# Altium schematic sheet [16] - POWERS 5V, 3V3.SchDoc
size A2; DocumentNumber: 2; SheetNumber: 16; SheetTotal: 20
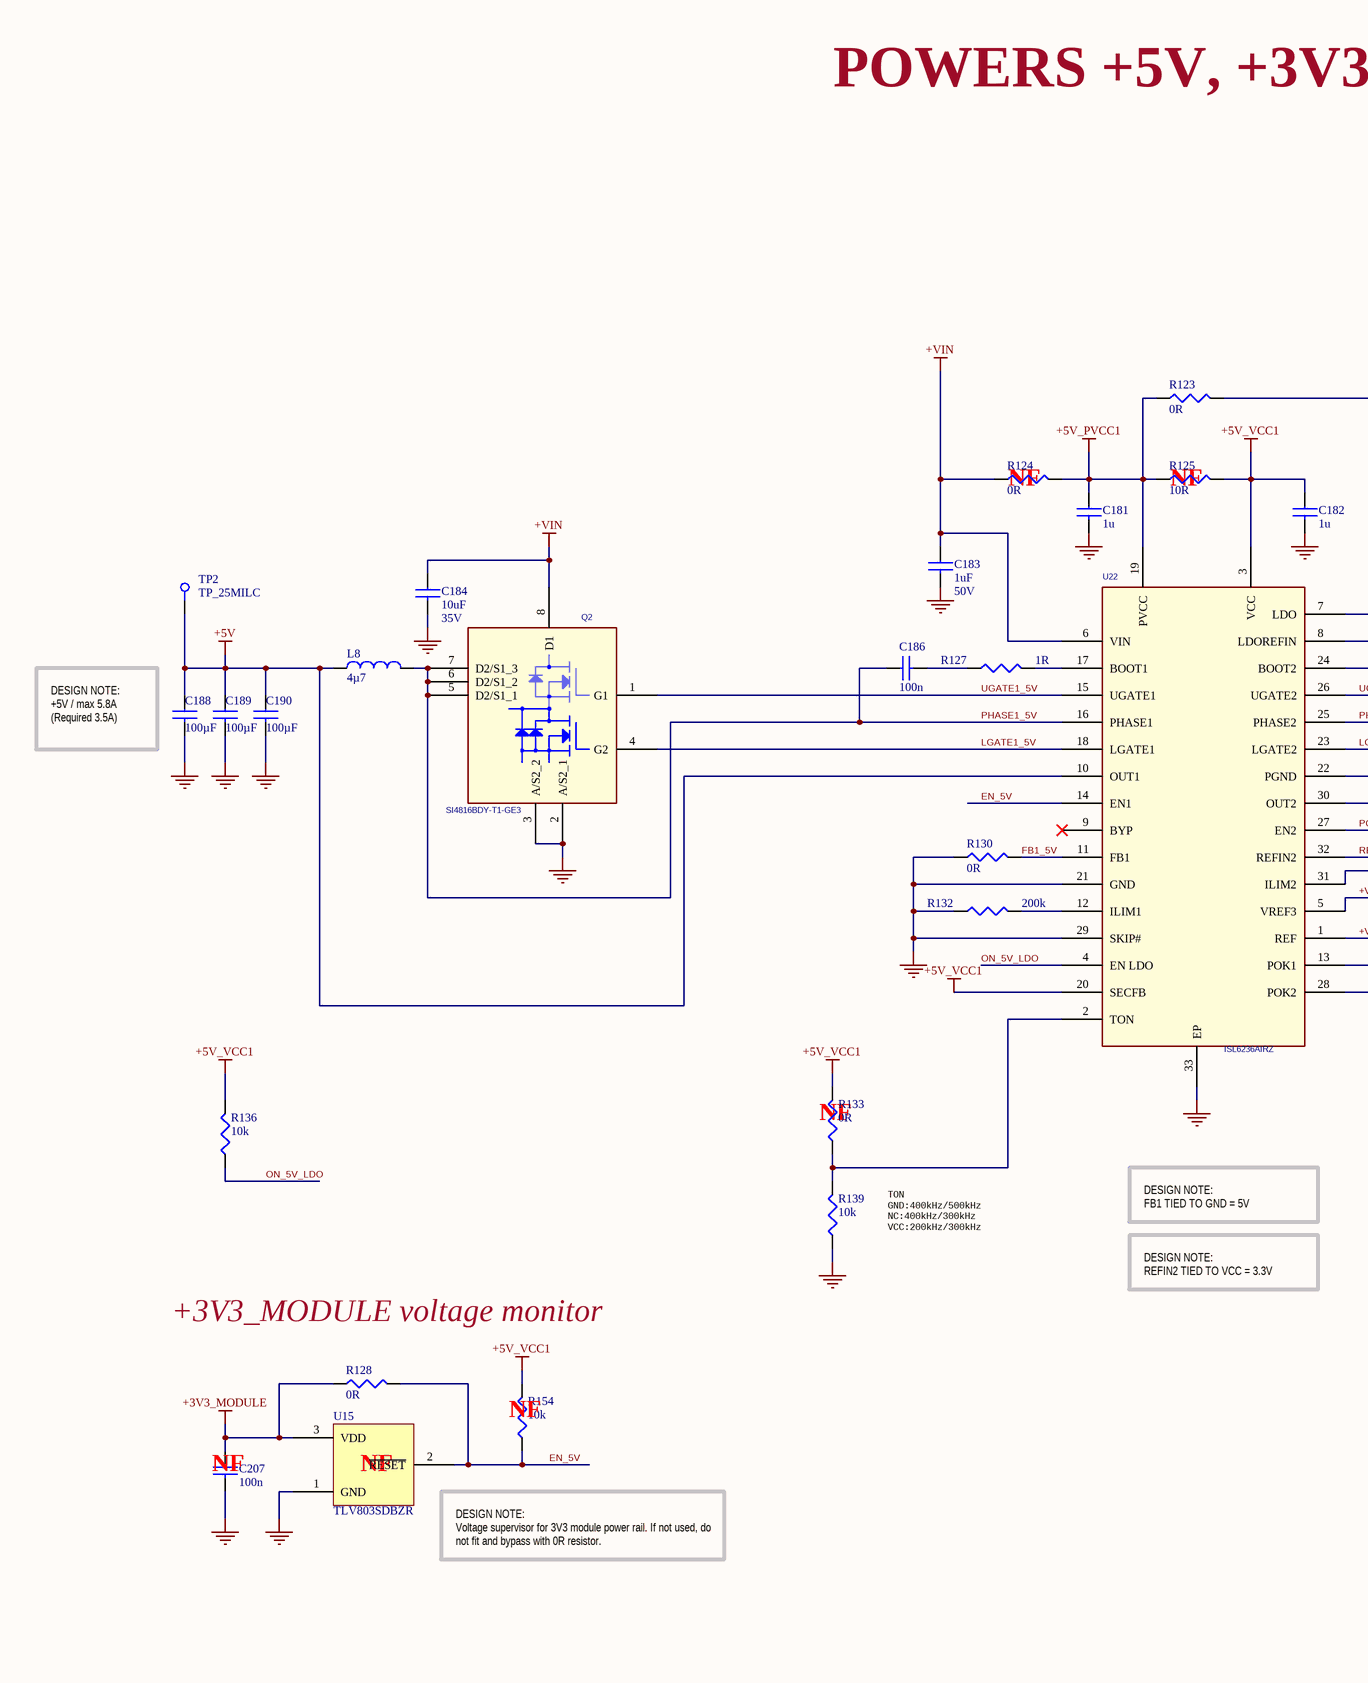
[diagram p0: [16] - POWERS 5V, 3V3.SchDoc, left]
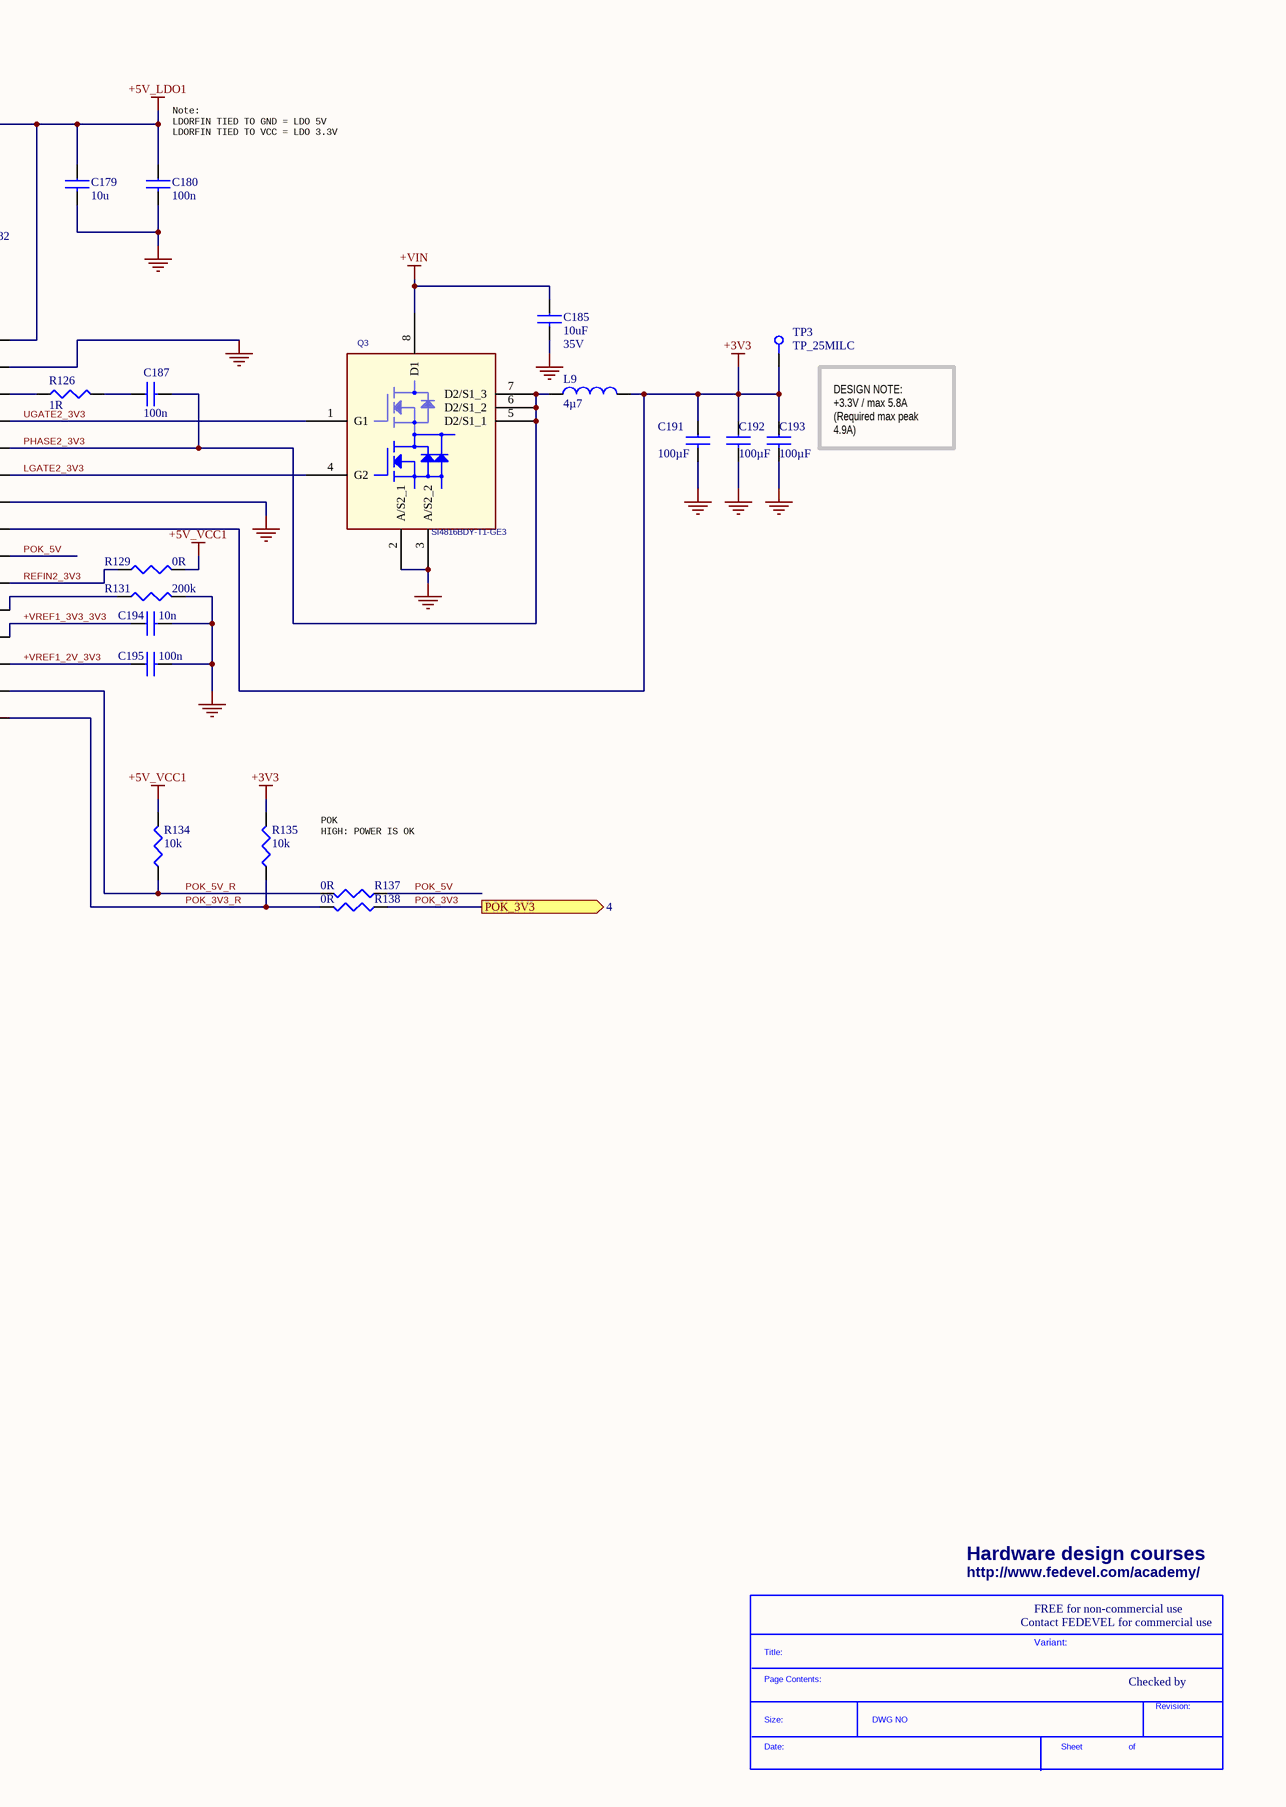
[diagram p1: [16] - POWERS 5V, 3V3.SchDoc, right]

## Parts
*  SDTitleBlock  (value not drawn)  (graphical)
C179  10u  [C0603]
C180  100n  [C0402]
C181  1u  [C0402]
C182  1u  [C0402]
C183  1uF  Voltage - Rated: 50V  [C0805]
C184  10uF  Voltage - Rated: 35V  [C1206]
C185  10uF  Voltage - Rated: 35V  [C1206]
C186  100n  [C0402]
C187  100n  [C0402]
C188  100µF  [C1206]
C189  100µF  [C1206]
C190  100µF  [C1206]
C191  100µF  [C1206]
C192  100µF  [C1206]
C193  100µF  [C1206]
C194  10n  [C0402]
C195  100n  [C0402]
C207  100n  [C0402]
L8  4µ7  [IHLP_255MILx270MIL]
L9  4µ7  [IHLP_255MILx270MIL]
Q2  SI4816BDY-T1-GE3  [8_SOIC_3.9MM]
Q3  SI4816BDY-T1-GE3  [8_SOIC_3.9MM]
R123  0R  [R0402]
R124  0R  [R0402]
R125  10R  [R0402]
R126  1R  [R0402]
R127  1R  [R0402]
R128  0R  [R0402]
R129  0R  [R0402]
R130  0R  [R0402]
R131  200k  [R0402]
R132  200k  [R0402]
R133  0R  [R0402]
R134  10k  [R0402]
R135  10k  [R0402]
R136  10k  [R0402]
R137  0R  [R0402]
R138  0R  [R0402]
R139  10k  [R0402]
R154  10k  [R0402]
TP2  TP_25MILC  [TP_25C]  (no BOM)
TP3  TP_25MILC  [TP_25C]  (no BOM)
U15  TLV803SDBZR  [DBZ]
U22  ISL6236AIRZ  [32_VFQFN_EXPOSED_PAD]

## Ports
POK_3V3 (see 4)

## Nets
+3V3: C191.1 C192.1 C193.1 L9.2 R135.2 TP3.1 U22.30(OUT2)
+3V3_MODULE: C207.1 R128.1 U15.3(VDD)
+5V: C188.1 C189.1 C190.1 L8.1 TP2.1 U22.10(OUT1)
+5V_LDO1: C179.1 C180.1 R123.2 U22.7(LDO)
+5V_PVCC1: C181.1 R123.1 R124.2 R125.1 U22.19(PVCC)
+5V_VCC1: C182.1 R125.2 R129.2 R133.2 R134.2 R136.2 R154.2 U22.3(VCC) U22.20(SECFB)
+VIN: C183.1 C184.1 C185.1 Q2.8(D1) Q3.8(D1) R124.1 U22.6(VIN)
GND: C179.2 C180.2 C181.2 C182.2 C183.2 C184.2 C185.2 C188.2 C189.2 C190.2 C191.2 C192.2 C193.2 C194.2 C195.2 C207.2 Q2.2(A/S2_1) Q2.3(A/S2_2) Q3.2(A/S2_1) Q3.3(A/S2_2) R130.1 R131.2 R132.1 R139.1 U15.1(GND) U22.8(LDOREFIN) U22.21(GND) U22.22(PGND) U22.29(SKIP#) U22.33(EP)
+VREF1_2V_3V3: C195.1 U22.1(REF)
+VREF1_3V3_3V3: C194.1 U22.5(VREF3)
EN_5V: R128.2 R154.1 U15.2(~{RESET}) U22.14(EN1)
FB1_5V: R130.2 U22.11(FB1)
LGATE1_5V: Q2.4(G2) U22.18(LGATE1)
LGATE2_3V3: Q3.4(G2) U22.23(LGATE2)
ON_5V_LDO: R136.1 U22.4(EN_LDO)
PHASE1_5V: C186.1 L8.2 Q2.5(D2/S1_1) Q2.6(D2/S1_2) Q2.7(D2/S1_3) U22.16(PHASE1)
PHASE2_3V3: C187.2 L9.1 Q3.5(D2/S1_1) Q3.6(D2/S1_2) Q3.7(D2/S1_3) U22.25(PHASE2)
POK_3V3: R138.1 ; port POK_3V3
POK_3V3_R: R135.1 R138.2 U22.28(POK2)
POK_5V: R137.1 U22.27(EN2)
POK_5V_R: R134.1 R137.2 U22.13(POK1)
REFIN2_3V3: R129.1 U22.32(REFIN2)
UGATE1_5V: Q2.1(G1) U22.15(UGATE1)
UGATE2_3V3: Q3.1(G1) U22.26(UGATE2)
NetC186_2: C186.2 R127.1
NetC187_1: C187.1 R126.2
NetR126_1: R126.1 U22.24(BOOT2)
NetR127_2: R127.2 U22.17(BOOT1)
NetR131_1: R131.1 U22.31(ILIM2)
NetR132_2: R132.2 U22.12(ILIM1)
NetR133_1: R133.1 R139.2 U22.2(TON)

Not connected (* = marked no-connect by the designer): U22 9(BYP)*

## Notes on the sheet
- POWERS +5V, +3V3
- (near C180) Note:
  LDORFIN TIED TO GND = LDO 5V
  LDORFIN TIED TO VCC = LDO 3.3V
- (near R124) NF
- (near R125) NF
- (near C188) DESIGN NOTE:
  +5V / max 5.8A
  (Required 3.5A)
- DESIGN NOTE:
  +3.3V / max 5.8A
  (Required max peak 4.9A)
- (near R133) NF
- POK
  HIGH: POWER IS OK
- DESIGN NOTE:
  FB1 TIED TO GND = 5V
- TON
  GND:400kHz/500kHz
  NC:400kHz/300kHz
  VCC:200kHz/300kHz
- DESIGN NOTE:
  REFIN2 TIED TO VCC = 3.3V
- +3V3_MODULE voltage monitor
- (near R154) NF
- (near C207) NF
- (near U15) NF
- DESIGN NOTE:
  Voltage supervisor for 3V3 module power rail. If not used, do not fit and bypass with 0R resistor.
- Hardware design courses
- http://www.fedevel.com/academy/
- Contact FEDEVEL for commercial use
- FREE for non-commercial use
- Variant:
- Checked by
- (in symbol SDTitleBlock) Title:; Page Contents:; Revision:; Size:; DWG NO; Date:; Sheet; of

## Library data of the parts
C179 = C1608X5R0J106M: CAP CER 10UF 6.3V X5R 20% 0603; Manufacturer: TDK Corporation; Capacitance: 10µF; Value: 10µF; .Checked PCB: used; Description: CAP CER 10UF 6.3V 20% X5R 0603; Category: Capacitors; Manufacturer Part Number: C1608X5R0J106M; Operating Temperature: -55°C ~ 85°C; Package / Case: 0603 (1608 Metric); Price 1k [$]: 0.08580; .Checked SCH: used; Voltage - Rated: 6.3V; Features: Low ESR; Supplier Part Number: 445-4112-1-ND; Supplier: Digikey; Supplier 1: Digi-Key; Supplier Part Number 1: 445-4112-1-ND; RoHS: RoHS Compliant; Stock 1: 48157; Pricing 1: 1=0.46, 10=0.363, 100=0.1898, 250=0.14024, 500=0.1089, 1000=0.0858 (USD); Tolerance: ±20%; Temperature Coefficient: X5R; Mounting Type: Surface Mount, MLCC; Applications: General Purpose; Ratings: -; Size / Dimension: 0.063" L x 0.031" W (1.60mm x 0.80mm); Height - Seated (Max): -; Thickness (Max): 0.037" (0.95mm); Lead Spacing: -; Packaging: Cut Tape (CT); Lead Style: -; ComponentLink1URL: http://www.tdk.com/pdf/general_B11.pdf; ComponentLink1Description: http://www.tdk.com/pdf/general_B11.pdf
C180 C186 C187 C195 C207 = C1005X5R1H104K: CAP CER .10UF 50V X5R 10% 0402; Manufacturer: TDK Corporation; Capacitance: 0.1µF; Value: 100nF; .Checked PCB: used; Description: CAP CER 0.1UF 50V 10% X5R 0402; Category: Capacitors; Manufacturer Part Number: C1005X5R1H104K; Operating Temperature: -55°C ~ 85°C; Package / Case: 0402 (1005 Metric); Price 1k [$]: 0.02340; .Checked SCH: used; Voltage - Rated: 50V; Supplier Part Number: 445-5942-1-ND; Supplier: Digikey; Supplier 1: Digi-Key; Supplier Part Number 1: 445-5942-1-ND; RoHS: RoHS Compliant; Stock 1: 106926; Pricing 1: 1=0.27, 10=0.18, 100=0.072, 250=0.05176, 500=0.0369, 1000=0.027 (USD); Tolerance: ±10%; Temperature Coefficient: X5R; Mounting Type: Surface Mount, MLCC; Applications: General Purpose; Ratings: -; Size / Dimension: 0.039" L x 0.020" W (1.00mm x 0.50mm); Height - Seated (Max): -; Thickness (Max): 0.022" (0.55mm); Lead Spacing: -; Features: -; Packaging: Cut Tape (CT); Lead Style: -; ComponentLink1URL: http://www.tdk.co.jp/tefe02/e412_c.pdf; ComponentLink1Description: http://www.tdk.co.jp/tefe02/e412_c.pdf
C181 C182 = C1005X5R1C105K: CAP CER 1.0UF 16V X5R 0402; Manufacturer: TDK Corporation; Capacitance: 1.0µF; Value: 1uF; .Checked PCB: used; Description: CAP CER 1UF 16V 10% X5R 0402; Tolerance: ±10%; Category: Capacitors; Manufacturer Part Number: C1005X5R1C105K; Operating Temperature: -55°C ~ 85°C; Package / Case: 0402 (1005 Metric); Price 1k [$]: 0.02080; .Checked SCH: used; Voltage - Rated: 16V; Supplier Part Number: 445-4978-1-ND; Supplier: Digikey; Supplier 1: Digi-Key; Supplier Part Number 1: 445-4978-1-ND; RoHS: RoHS Compliant; Stock 1: 341010; Pricing 1: 1=0.24, 10=0.16, 100=0.064, 250=0.046, 500=0.0328, 1000=0.024 (USD); Temperature Coefficient: X5R; Mounting Type: Surface Mount, MLCC; Applications: General Purpose; Ratings: -; Size / Dimension: 0.039" L x 0.020" W (1.00mm x 0.50mm); Height - Seated (Max): -; Thickness (Max): 0.022" (0.55mm); Lead Spacing: -; Features: -; Packaging: Cut Tape (CT); Lead Style: -; ComponentLink1URL: http://www.tdk.co.jp/tefe02/e412_c.pdf; ComponentLink1Description: http://www.tdk.co.jp/tefe02/e412_c.pdf
C183 = GRM21BR71H105KA12L: CAP CER 1UF 50V X7R 0805; Manufacturer: Murata Electronics North America; Capacitance: 1.0µF; .Checked PCB: used; Description: CAP CER 1UF 50V 10% X7R 0805; Tolerance: ±10%; Category: Capacitors; Manufacturer Part Number: GRM21BR71H105KA12L; Operating Temperature: -55°C ~ 125°C; Package / Case: 0805 (2012 Metric); Price 1k [$]: 0.1359; Value: 1uF; .Checked SCH: used; Supplier Part Number: 490-4736-1-ND; Supplier: Digikey; Supplier 1: Digi-Key; Supplier Part Number 1: 490-4736-1-ND; RoHS: RoHS Compliant; Stock 1: 422791; Pricing 1: 1=0.28, 10=0.254, 25=0.226, 50=0.1978, 100=0.1836, 250=0.16952, 500=0.16102, 750=0.14691, 1000=0.12995 (USD); Temperature Coefficient: X7R; Mounting Type: Surface Mount, MLCC; Applications: General Purpose; Ratings: -; Size / Dimension: 0.079" L x 0.049" W (2.00mm x 1.25mm); Height - Seated (Max): -; Thickness (Max): 0.053" (1.35mm); Lead Spacing: -; Features: -; Packaging: Cut Tape (CT); Lead Style: -; ComponentLink1URL: http://search.murata.co.jp/Ceramy/image/img/PDF/ENG/GRM21BR71H105KA12.pdf; ComponentLink1Description: http://search.murata.co.jp/Ceramy/image/img/PDF/ENG/GRM21BR71H105KA12.pdf
C184 C185 = GRM31CR6YA106KA12L: CAP CER 10UF 35V X5R 1206; Manufacturer: Murata Electronics North America; Capacitance: 10µF; .Checked PCB: used; Description: CAP CER 10UF 35V 10% X5R 1206; Tolerance: ±10%; Category: Capacitors; Manufacturer Part Number: GRM31CR6YA106KA12L; Operating Temperature: -55°C ~ 85°C; Package / Case: 1206 (3216 Metric); Price 1k [$]: 0.19448; Value: 10uF; .Checked SCH: used; Supplier Part Number: 490-5524-1-ND; Supplier: Digikey; Supplier 1: Digi-Key; Supplier Part Number 1: 490-5524-1-ND; RoHS: RoHS Compliant; Stock 1: 76334; Pricing 1: 1=0.6, 10=0.501, 50=0.359, 100=0.3142, 250=0.24684, 500=0.2244, 1000=0.17952 (USD); Temperature Coefficient: X5R; Mounting Type: Surface Mount, MLCC; Applications: General Purpose; Ratings: -; Size / Dimension: 0.126" L x 0.063" W (3.20mm x 1.60mm); Height - Seated (Max): -; Thickness (Max): 0.071" (1.80mm); Lead Spacing: -; Features: -; Packaging: Cut Tape (CT); Lead Style: -; ComponentLink1URL: http://www.murata.com/products/catalog/pdf/c02e.pdf; ComponentLink1Description: http://www.murata.com/products/catalog/pdf/c02e.pdf
C188-C193 = C3216X5R1A107M: CAP CER 100UF 10V X5R 20% 1206; Manufacturer: TDK Corporation; .Checked PCB: used; Description: CAP CER 100UF 10V 20% X5R 1206; Capacitance: 100µF; Category: Capacitors; Manufacturer Part Number: C3216X5R1A107M; Operating Temperature: -55°C ~ 85°C; Package / Case: 1206 (3216 Metric); Price 1k [$]: 0.85800; Value: 100µF; .Checked SCH: used; Voltage - Rated: 10V; Supplier Part Number: 445-6007-1-ND; Supplier: Digikey; Supplier 1: Digi-Key; Supplier Part Number 1: 445-6007-1-ND; RoHS: RoHS Compliant; Stock 1: 28026; Pricing 1: 1=1.65, 10=1.353, 100=1.089, 250=0.957, 500=0.891, 1000=0.693 (USD); Tolerance: ±20%; Temperature Coefficient: X5R; Mounting Type: Surface Mount, MLCC; Applications: General Purpose; Ratings: -; Size / Dimension: 0.126" L x 0.063" W (3.20mm x 1.60mm); Height - Seated (Max): -; Thickness (Max): 0.071" (1.80mm); Lead Spacing: -; Features: -; Packaging: Cut Tape (CT); Lead Style: -; ComponentLink1URL: http://www.tdk.com/pdf/general_B11.pdf; ComponentLink1Description: http://www.tdk.com/pdf/general_B11.pdf
C194 = C1005X7R1C103K: CAP CER 10000PF 16V X7R 10% 0402; Manufacturer: TDK Corporation; Value: 10nF; .Checked PCB: used; Description: CAP CER 10000PF 16V 10% X7R 0402; Capacitance: 10000pF; Category: Capacitors; Manufacturer Part Number: C1005X7R1C103K; Operating Temperature: -55°C ~ 125°C; Package / Case: 0402 (1005 Metric); Price 1k [$]: 0.00416; .Checked SCH: used; Voltage - Rated: 16V; Supplier Part Number: 445-1262-1-ND; Supplier: Digikey; Supplier 1: Digi-Key; Supplier Part Number 1: 445-1262-1-ND; RoHS: RoHS Compliant; Stock 1: 511497; Pricing 1: 1=0.08, 10=0.05, 100=0.018, 250=0.013, 500=0.0096, 1000=0.0065 (USD); Tolerance: ±10%; Temperature Coefficient: X7R; Mounting Type: Surface Mount, MLCC; Applications: General Purpose; Ratings: -; Size / Dimension: 0.039" L x 0.020" W (1.00mm x 0.50mm); Height - Seated (Max): -; Thickness (Max): 0.022" (0.55mm); Lead Spacing: -; Features: -; Packaging: Cut Tape (CT); Lead Style: -; ComponentLink1URL: http://www.tdk.co.jp/tefe02/e412_c.pdf; ComponentLink1Description: http://www.tdk.co.jp/tefe02/e412_c.pdf
L8 L9 = IHLP2525CZER4R7M01: INDUCTOR POWER 4.7UH 5.5A SMD; Manufacturer: Vishay/Dale; .Checked PCB: used; Inductance: 4.7µH; Current - Saturation: 10A; Shielding: Shielded; DC Resistance (DCR): 40 mOhm Max; Tolerance: ±20%; Frequency - Test: 100kHz; .Checked SCH: used; Category: Inductors, Coils, Chokes; Manufacturer Part Number: IHLP2525CZER4R7M01; Operating Temperature: -55°C ~ 125°C; Package / Case: 0.270" L x 0.255" W x 0.118" H (6.86mm x 6.47mm x 3.00mm); Price 1k [$]: 1.09800; Value: 4µ7; Current: 5.5A; Applications: General Purpose; Supplier Part Number: 541-1010-1-ND; Supplier: Digikey; Supplier 1: Digi-Key; Supplier Part Number 1: 541-1010-1-ND; RoHS: RoHS Compliant; Stock 1: 25684; Pricing 1: 1=2.26, 10=1.83, 100=1.525, 500=1.22, 1000=1.098 (USD); Current - Temperature Rise: 5.5A; Type: -; Q @ Freq: -; Frequency - Self Resonant: -; Material - Core: -; Mounting Type: Surface Mount; Packaging: Cut Tape (CT); ComponentLink1URL: http://www.vishay.com/doc?34104; ComponentLink1Description: http://www.vishay.com/doc?34104
Q2 Q3 = SI4816BDY-T1-GE3: MOSFET DL N-CH 30V 6.8A 8-SOIC; Manufacturer: Vishay/Siliconix; .Checked PCB: used; FET Type: 2 N-Channel (Dual); FET Feature: Logic Level Gate; Rds On (Max) @ Id, Vgs: 18.5 mOhm @ 6.8A, 10V; Current - Continuous Drain (Id) @ 25° C: 5.8A, 8.2A; Vgs(th) (Max) @ Id: 3V @ 250µA; Power - Max: 1W, 1.25W; Gate Charge (Qg) @ Vgs: 10nC @ 5V; .Checked SCH: used; Category: Discrete Semiconductor Products; Manufacturer Part Number: SI4816BDY-T1-GE3; Package / Case: 8-SOIC (0.154", 3.90mm Width); Price 1k [$]: 0.84800; Value: SI4816BDY-T1-GE3; Family: FETs - Arrays; Drain to Source Voltage (Vdss): 30V; Supplier Part Number: SI4816BDY-T1-GE3CT-ND; Supplier: Digikey; Supplier 1: Digi-Key; Supplier Part Number 1: SI4816BDY-T1-GE3CT-ND; RoHS: RoHS Compliant; Stock 1: 15735; Pricing 1: 1=1.84, 25=1.4228, 100=1.2912, 250=1.1594, 500=1.0013, 1000=0.8432 (USD); Input Capacitance (Ciss) @ Vds: -; Mounting Type: Surface Mount; Supplier Device Package: 8-SOICN; Packaging: Cut Tape (CT); ComponentLink1URL: http://www.vishay.com/docs/73026/si4816bd.pdf; ComponentLink1Description: http://www.vishay.com/docs/73026/si4816bd.pdf
R123 R124 R128-R130 R133 R137 R138 = RC0402JR-070RL: RES 0.0 OHM 1/16W 0402 SMD; Manufacturer: Yageo; Resistance (Ohms): 0.0; Power (Watts): 0.063W, 1/16W; Tolerance: Jumper; .Checked PCB: used; Category: Resistors; Manufacturer Part Number: RC0402JR-070RL; Package / Case: 0402 (1005 Metric); Price 1k [$]: 0.01389; Value: 0R; .Checked SCH: used; Supplier Part Number: 311-0.0JRCT-ND; Supplier: Digikey; Supplier 1: Digi-Key; Supplier Part Number 1: 311-0.0JRCT-ND; RoHS: RoHS Compliant; Stock 1: 1106330; Pricing 1: 10=0.012, 50=0.009, 100=0.0069, 250=0.00512, 500=0.0038, 1000=0.00253 (USD); Composition: Thick Film; Features: -; Temperature Coefficient: -; Size / Dimension: 0.039" L x 0.020" W (1.00mm x 0.50mm); Height: 0.016" (0.40mm); Number of Terminations: 2; Packaging: Cut Tape (CT); ComponentLink1URL: http://www.yageo.com/documents/recent/PYu-RC0402_51_RoHS_L_6.pdf; ComponentLink1Description: http://www.yageo.com/documents/recent/PYu-RC0402_51_RoHS_L_6.pdf
R125 = RC0402FR-0710RL: RES 10.0 OHM 1/16W 1% 0402 SMD; Manufacturer: Yageo; Resistance (Ohms): 10; Power (Watts): 0.063W, 1/16W; .Checked PCB: used; Temperature Coefficient: ±200ppm/°C; Category: Resistors; Manufacturer Part Number: RC0402FR-0710RL; Package / Case: 0402 (1005 Metric); Price 1k [$]: 0.01421; Tolerance: ±1%; Value: 10R; .Checked SCH: used; Supplier Part Number: 311-10.0LRCT-ND; Supplier: Digikey; Supplier 1: Digi-Key; Supplier Part Number 1: 311-10.0LRCT-ND; RoHS: RoHS Compliant; Stock 1: 681416; Pricing 1: 10=0.014, 50=0.0104, 100=0.0079, 250=0.00584, 500=0.00432, 1000=0.00288 (USD); Composition: Thick Film; Features: -; Size / Dimension: 0.039" L x 0.020" W (1.00mm x 0.50mm); Height: 0.016" (0.40mm); Number of Terminations: 2; Packaging: Cut Tape (CT); ComponentLink1URL: http://www.yageo.com/documents/recent/PYu-RC0402_51_RoHS_L_6.pdf; ComponentLink1Description: http://www.yageo.com/documents/recent/PYu-RC0402_51_RoHS_L_6.pdf
R126 R127 = RC0402FR-071RL: RES 1.00 OHM 1/16W 1% 0402 SM; Manufacturer: Yageo; Resistance (Ohms): 1; Power (Watts): 0.063W, 1/16W; .Checked PCB: used; Description: RES 1.00 OHM 1/16W 1% 0402 SMD; Temperature Coefficient: ±200ppm/°C; Category: Resistors; Manufacturer Part Number: RC0402FR-071RL; Package / Case: 0402 (1005 Metric); Price 1k [$]: 0.01421; Tolerance: ±1%; Value: 1R; .Checked SCH: used; Supplier Part Number: 311-1.00LRCT-ND; Supplier: Digikey; Supplier 1: Digi-Key; Supplier Part Number 1: 311-1.00LRCT-ND; RoHS: RoHS Compliant; Stock 1: 347765; Pricing 1: 10=0.019, 50=0.0142, 100=0.0109, 250=0.00808, 500=0.00596, 1000=0.00397 (USD); Composition: Thick Film; Features: -; Size / Dimension: 0.039" L x 0.020" W (1.00mm x 0.50mm); Height: 0.016" (0.40mm); Number of Terminations: 2; Packaging: Cut Tape (CT); ComponentLink1URL: http://www.yageo.com/documents/recent/PYu-RC0402_51_RoHS_L_6.pdf; ComponentLink1Description: http://www.yageo.com/documents/recent/PYu-RC0402_51_RoHS_L_6.pdf
R131 R132 = RC0402FR-07200KL: RES 200K OHM 1/16W 1% 0402 SMD; Manufacturer: Yageo; Power (Watts): 0.063W, 1/16W; .Checked PCB: used; Temperature Coefficient: ±100ppm/°C; Category: Resistors; Manufacturer Part Number: RC0402FR-07200KL; Package / Case: 0402 (1005 Metric); Price 1k [$]: 0.01421; Resistance (Ohms): 200K; Tolerance: ±1%; Value: 200k; .Checked SCH: used; Supplier Part Number: 311-200KLRCT-ND; Supplier: Digikey; Supplier 1: Digi-Key; Supplier Part Number 1: 311-200KLRCT-ND; RoHS: RoHS Compliant; Stock 1: 225869; Pricing 1: 10=0.014, 50=0.0104, 100=0.0079, 250=0.00584, 500=0.00432, 1000=0.00288 (USD); Composition: Thick Film; Features: -; Size / Dimension: 0.039" L x 0.020" W (1.00mm x 0.50mm); Height: 0.016" (0.40mm); Number of Terminations: 2; Packaging: Cut Tape (CT); ComponentLink1URL: http://www.yageo.com/documents/recent/PYu-RC0402_51_RoHS_L_6.pdf; ComponentLink1Description: http://www.yageo.com/documents/recent/PYu-RC0402_51_RoHS_L_6.pdf
R134-R136 R139 R154 = RC0402FR-0710KL: RES 10.0K OHM 1/16W 1% 0402 SMD; Manufacturer: Yageo; Power (Watts): 0.063W, 1/16W; .Checked PCB: used; Temperature Coefficient: ±100ppm/°C; Category: Resistors; Manufacturer Part Number: RC0402FR-0710KL; Package / Case: 0402 (1005 Metric); Price 1k [$]: 0.01421; Resistance (Ohms): 10K; Tolerance: ±1%; Value: 10k; .Checked SCH: used; Supplier Part Number: 311-10.0KLRCT-ND; Supplier: Digikey; Supplier 1: Digi-Key; Supplier Part Number 1: 311-10.0KLRCT-ND; RoHS: RoHS Compliant; Stock 1: 2916495; Pricing 1: 10=0.014, 50=0.0104, 100=0.0079, 250=0.00584, 500=0.00432, 1000=0.00288 (USD); Composition: Thick Film; Features: -; Size / Dimension: 0.039" L x 0.020" W (1.00mm x 0.50mm); Height: 0.016" (0.40mm); Number of Terminations: 2; Packaging: Cut Tape (CT); ComponentLink1URL: http://www.yageo.com/documents/recent/PYu-RC0402_51_RoHS_L_6.pdf; ComponentLink1Description: http://www.yageo.com/documents/recent/PYu-RC0402_51_RoHS_L_6.pdf
TP2 TP3 = TP_25MILC: Test Point 25mil
U15 = TLV803SDBZR: IC VOLT SUPERVISR 2.93V SOT23-3; Manufacturer: Texas Instruments; Number of Voltages Monitored: 1; Output: Open Drain or Open Collector; Reset: Active Low; Reset Timeout: 120 ms Minimum; .Creator: MM; Supplier 1: Digi-Key; Manufacturer Part Number: TLV803SDBZR; RoHS: RoHS Compliant; Category: Integrated Circuits (ICs); Stock 1: 5869; Pricing 1: 1=0.66, 10=0.578, 25=0.5104, 100=0.216, 250=0.212, 500=0.208, 750=0.204 (USD); Packaging: Cut Tape (CT); Type: Simple Reset/Power-On Reset; Voltage - Threshold: 2.93V; Operating Temperature: -40°C ~ 125°C; Mounting Type: Surface Mount; Package / Case: TO-236-3, SC-59, SOT-23-3; Supplier Device Package: SOT-23-3; ComponentLink1URL: http://www.ti.com/lit/ds/symlink/tlv803m.pdf; ComponentLink1Description: http://www.ti.com/lit/ds/symlink/tlv803m.pdf; Supplier Part Number 1: 296-29196-1-ND; .Checked PCB: MM; .Checked SCH: MM
U22 = ISL6236AIRZ: IC MAIN PWR CTRLR QUAD 32-QFN; Manufacturer: Intersil; .Checked PCB: used; Voltage - Input: 4.5 V ~ 25 V; Number of Outputs: 4; Voltage - Output: Multiple; .Checked SCH: used; Category: Integrated Circuits (ICs); Manufacturer Part Number: ISL6236AIRZ; Operating Temperature: -40°C ~ 100°C; Package / Case: 32-VFQFN Exposed Pad; Price 1k [$]: 3.0840; Value: ISL6236AIRZ; Family: PMIC - Voltage Regulators - Special Purpose; Supplier Part Number: ISL6236AIRZ-ND; Supplier: Digikey; Supplier 1: Digi-Key; Supplier Part Number 1: ISL6236AIRZ-ND; RoHS: RoHS Compliant; Stock 1: 0; Pricing 1: 600=4.28 (USD); Applications: Controller, Notebook Power System; Mounting Type: Surface Mount; Supplier Device Package: 32-QFN Exposed Pad (5x5); Packaging: Tube; ComponentLink1URL: http://www.intersil.com/data/fn/fn6453.pdf; ComponentLink1Description: http://www.intersil.com/data/fn/fn6453.pdf